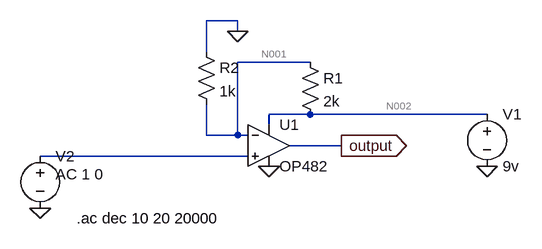
[diagram p0: schematic Draft3.asc]
Draft3.asc, the LTspice schematic file:
Version 4.1
SHEET 1 880 680
WIRE -16 0 -64 0
WIRE -16 16 -16 0
WIRE -64 48 -64 0
WIRE 96 64 -16 64
WIRE 96 144 32 144
WIRE 368 144 96 144
WIRE 32 160 32 144
WIRE -64 176 -64 128
WIRE -16 176 -16 64
WIRE -16 176 -64 176
WIRE 0 176 -16 176
WIRE 144 192 64 192
WIRE 0 208 -320 208
FLAG -320 288 0
FLAG 32 224 0
FLAG 368 224 0
FLAG -16 16 0
FLAG 144 192 output
IOPIN 144 192 Out
SYMBOL voltage 368 128 R0
WINDOW 123 0 0 Left 0
WINDOW 39 0 0 Left 0
SYMATTR InstName V1
SYMATTR Value 9v
SYMBOL OpAmps\\OP482 32 128 R0
SYMATTR InstName U1
SYMBOL voltage -320 192 R0
WINDOW 123 24 44 Left 2
WINDOW 39 0 0 Left 0
SYMATTR InstName V2
SYMATTR Value ""
SYMATTR Value2 AC 1 0
SYMBOL res 80 48 R0
SYMATTR InstName R1
SYMATTR Value 2k
SYMBOL res -80 32 R0
SYMATTR InstName R2
SYMATTR Value 1k
TEXT -264 304 Left 2 !.ac dec 10 20 20000

The netlist it stands for:
* Draft3.asc
V1 N002 0 9v
X§U1 N003 N001 N002 0 output OP482  ; pins In+ In- V+ V- OUT
V2 N003 0 AC 1 0
R1 N001 N002 2k
R2 0 N001 1k
.ac dec 10 20 20000
.backanno
.end

* Results of the author's LTspice run, read from the files saved beside the schematic
* Operating Point, zero values left out:
*   V(n001) = 3 V
*   V(n002) = 9 V
*   V(output) = 8.326 V
*   I(R1) = -3 mA
*   I(R2) = -3 mA
*   I(V1) = -4.004 mA
*   I(V2) = 50 nA
*   Ix(u1:1) = -50 nA
*   Ix(u1:2) = -16.88 nA
*   Ix(u1:3) = 1.004 mA
*   Ix(u1:4) = -1.004 mA
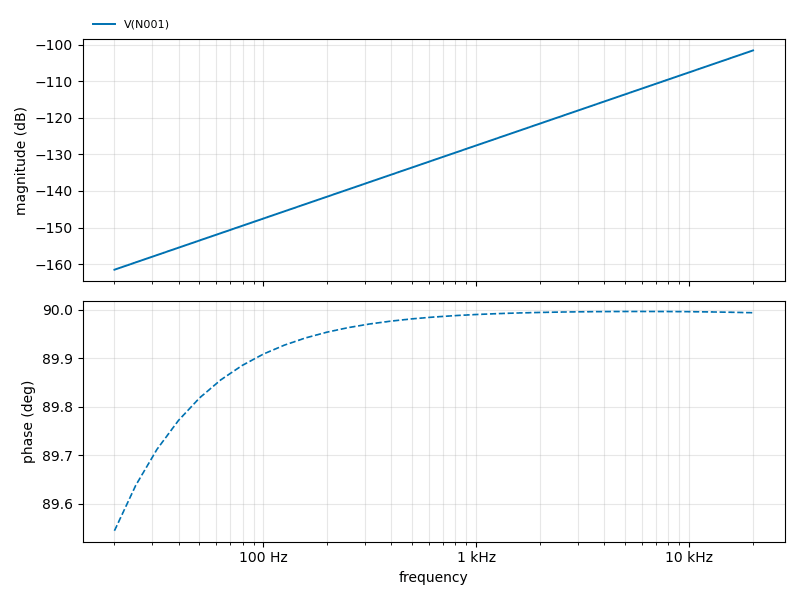
[diagram p1: AC Analysis of Draft3.asc, plotted from the saved traces]
* AC Analysis, 1 run:
*   V(N001): -161.54 dB at 20 Hz, -101.54 dB at 20 kHz, peak -101.54 dB at 20 kHz, 3 dB below the peak at 14.14 kHz